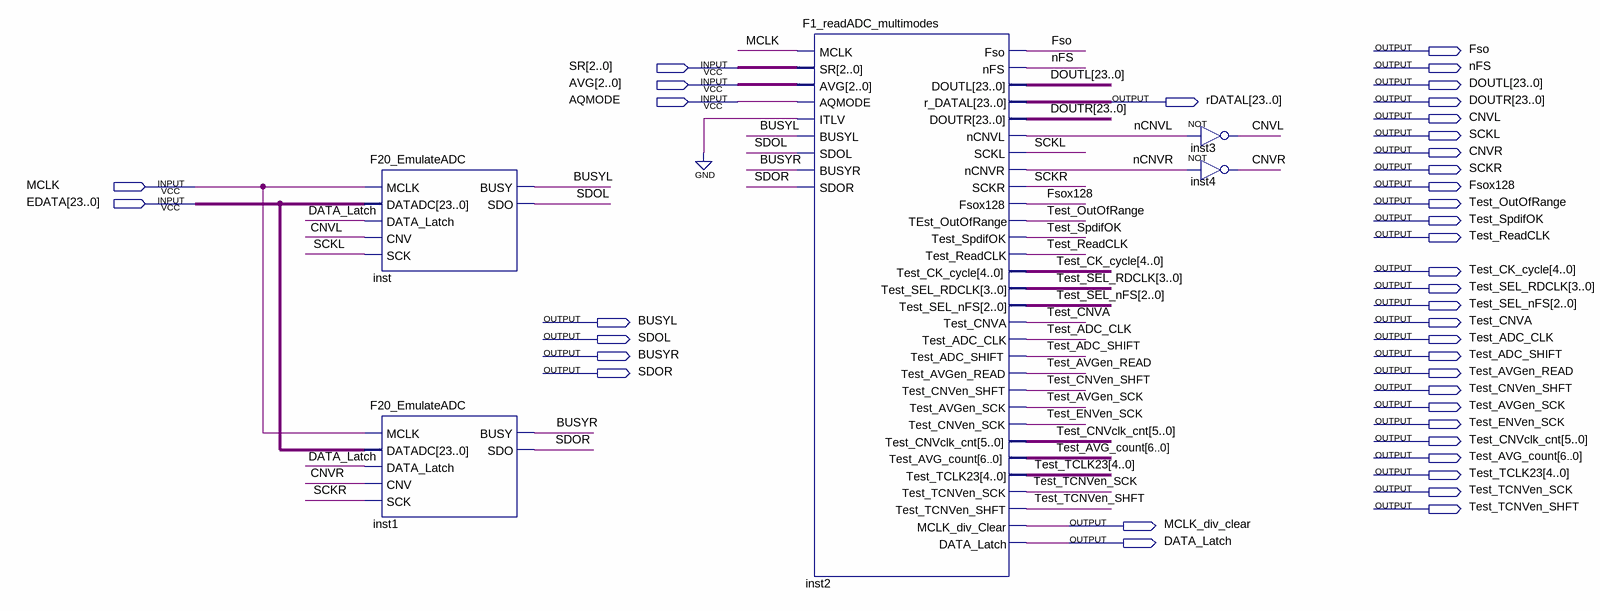
[diagram p0: schematic sheet]
// Quartus schematic F00_TestADC.bdf as structural Verilog: 5 symbols, 39 pins
module F00_TestADC (
  input  [2:0] SR,
  input  [2:0] AVG,
  input  AQMODE,
  input  MCLK,
  input  [23:0] EDATA,
  output Fso,
  output nFS,
  output [23:0] DOUTL,
  output [23:0] rDATAL,
  output [23:0] DOUTR,
  output CNVL,
  output SCKL,
  output CNVR,
  output SCKR,
  output Fsox128,
  output Test_OutOfRange,
  output Test_SpdifOK,
  output Test_ReadCLK,
  output [4:0] Test_CK_cycle,
  output [3:0] Test_SEL_RDCLK,
  output [2:0] Test_SEL_nFS,
  output BUSYL,
  output Test_CNVA,
  output SDOL,
  output Test_ADC_CLK,
  output BUSYR,
  output Test_ADC_SHIFT,
  output SDOR,
  output Test_AVGen_READ,
  output Test_CNVen_SHFT,
  output Test_AVGen_SCK,
  output Test_ENVen_SCK,
  output [5:0] Test_CNVclk_cnt,
  output [6:0] Test_AVG_count,
  output [4:0] Test_TCLK23,
  output Test_TCNVen_SCK,
  output Test_TCNVen_SHFT,
  output MCLK_div_clear,
  output DATA_Latch
);

  wire nCNVL, nCNVR;

  F20_EmulateADC inst (
    .MCLK(MCLK), .DATADC(EDATA), .DATA_Latch(DATA_Latch), .CNV(CNVL), .SCK(SCKL), .BUSY(BUSYL), .SDO(SDOL));
  F20_EmulateADC inst1 (
    .MCLK(MCLK), .DATADC(EDATA), .DATA_Latch(DATA_Latch), .CNV(CNVR), .SCK(SCKR), .BUSY(BUSYR), .SDO(SDOR));
  F1_readADC_multimodes inst2 (
    .MCLK(MCLK), .SR(SR), .AVG(AVG), .AQMODE(AQMODE), .ITLV(1'b0), .BUSYL(BUSYL), .SDOL(SDOL), .BUSYR(BUSYR),
    .SDOR(SDOR), .Fso(Fso), .nFS(nFS), .DOUTL(DOUTL), .r_DATAL(rDATAL), .DOUTR(DOUTR), .nCNVL(nCNVL),
    .SCKL(SCKL), .nCNVR(nCNVR), .SCKR(SCKR), .Fsox128(Fsox128), .TEst_OutOfRange(Test_OutOfRange),
    .Test_SpdifOK(Test_SpdifOK), .Test_ReadCLK(Test_ReadCLK), .Test_CK_cycle(Test_CK_cycle),
    .Test_SEL_RDCLK(Test_SEL_RDCLK), .Test_SEL_nFS(Test_SEL_nFS), .Test_CNVA(Test_CNVA),
    .Test_ADC_CLK(Test_ADC_CLK), .Test_ADC_SHIFT(Test_ADC_SHIFT), .Test_AVGen_READ(Test_AVGen_READ),
    .Test_CNVen_SHFT(Test_CNVen_SHFT), .Test_AVGen_SCK(Test_AVGen_SCK), .Test_CNVen_SCK(Test_ENVen_SCK),
    .Test_CNVclk_cnt(Test_CNVclk_cnt), .Test_AVG_count(Test_AVG_count), .Test_TCLK23(Test_TCLK23),
    .Test_TCNVen_SCK(Test_TCNVen_SCK), .Test_TCNVen_SHFT(Test_TCNVen_SHFT), .MCLK_div_Clear(MCLK_div_clear),
    .DATA_Latch(DATA_Latch));
  not inst3 (CNVL, nCNVL);
  not inst4 (CNVR, nCNVR);
endmodule
